# Altium schematic sheet A4_Template.SchDoc: Desk Digital Clock
size A4; Author: Ramil Teregulov; DrawnBy: Ramil Teregulov; Engineer: Ramil Teregulov; Organization: Altium Limited; Revision: 1R0; SheetNumber: qwe; SheetTotal: 6; ProjectName: Desk Digital Clock
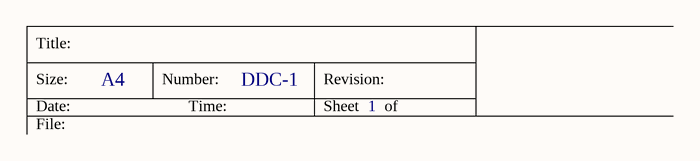
[diagram p0: A4_Template.SchDoc]

## Notes on the sheet
- Title:
- Size:
- Date:
- A4
- Number:
- Time:
- DDC-1
- Revision:
- Sheet
- 1
- of
- File: